# EAGLE design Ultrassom Breakout - V1 (EAGLE 9.6.2)

## Sheet 1 of 2
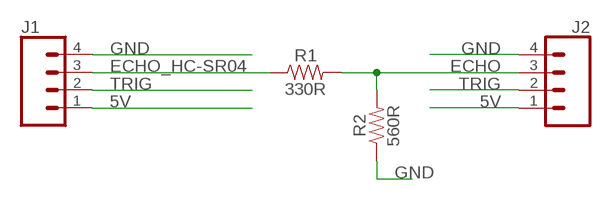
[diagram p0: schematic, sheet 1]

### Parts
J1  CONN_041X04_NO_SILK  [1X04_NO_SILK]
J2  CONN_041X04_NO_SILK  [1X04_NO_SILK]
R1  330R  RESISTORAXIAL-0.3-KIT  [AXIAL-0.3-KIT]
R2  560R  RESISTORAXIAL-0.3-KIT  [AXIAL-0.3-KIT]

### Nets
5V: J1.1 J2.1
ECHO: J2.3 R1.P$2 R2.P$2
ECHO_HC-SR04: J1.3 R1.P$1
GND: J1.4 J2.4 R2.P$1
TRIG: J1.2 J2.2

## Sheet 2 of 2

## Library data of the parts
J1 J2 = SparkFun-Connectors:CONN_04: Multi connection point. Often used as Generic Header-pin footprint for 0.1 inch spaced/style header connections On any of the 0.1 inch spaced packages, you can populate with these: Break Away Headers - Straight <https://www.sparkfun.com/products/116> (PRT-00116) Break Away Male Headers - Right Angle <https://www.sparkfun.com/products/553> (PRT-00553) Female Headers <https://www.sparkfun.com/products/115> (PRT-00115) Break Away Headers - Machine Pin <https://www.sparkfun.com/products/117> (PRT-00117) Break Away Female Headers - Swiss Machine Pin <https://www.sparkfun.com/products/743> (PRT-00743) For SCREWTERMINALS and SPRING TERMINALS visit here: Screw Terimnals on SparkFun.com <https://www.sparkfun.com/search/results?term=Screw+Terminals> (5mm/3.5mm/2.54mm spacing) This device is also useful as a general connection point to wire up your design to another part of your project. Our various solder wires solder well into these plated through hole pads. Hook-Up Wire - Assortment (Stranded, 22 AWG) <https://www.sparkfun.com/products/11375> (PRT-11375) Hook-Up Wire - Assortment (Solid Core, 22 AWG) <https://www.sparkfun.com/products/11367> (PRT-11367) View the entire wire category on our website here <https://www.sparkfun.com/categories/141> Special notes: Molex polarized connector foot print use with SKU : PRT-08231 with associated crimp pins and housings. 1MM SMD Version SKU: PRT-10208; PROD_ID: CONN-09696
R1 R2 = SparkFun-Resistors:RESISTOR: Generic Resistor Package

## Net classes
0 default: width 0.305 mm, drill 0.457 mm, clearance 0.254 mm

## Board
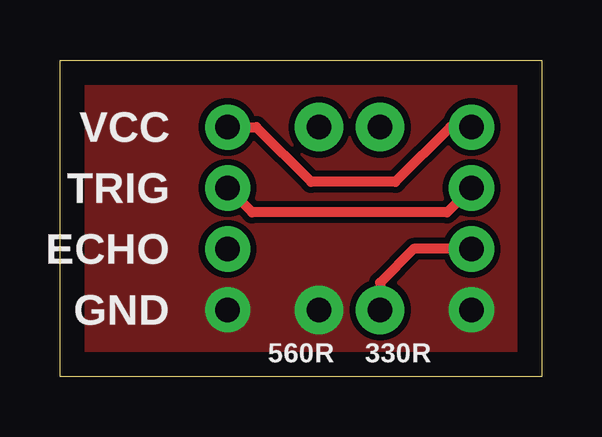
[diagram p1: board, top side]
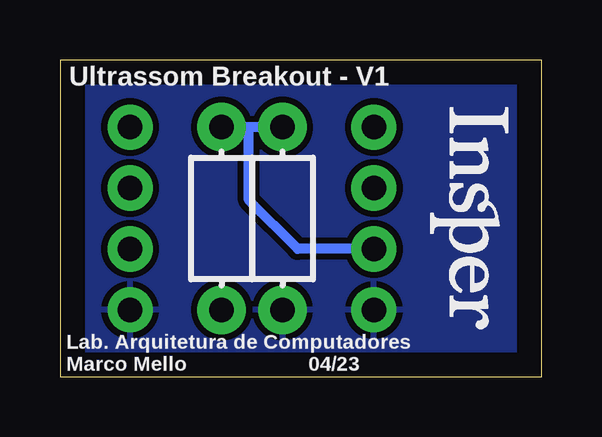
[diagram p2: board, bottom side, seen from below]

Size 20.07 x 13.21 mm. Coordinates in mm from the lower left corner, seen from the top.
Outline: 20.07,0 0,0 0,13.21 20.07,13.21 20.07,0
Copper layers (1*16): Top 0.035mm / dielectric 1.5mm / Bottom 0.035mm
Design rules "default": minimum track width 6mil, minimum drill 0.35mm, track to track 6mil, track to pad 6mil, pad to pad 6mil, via to via 6mil, smd to smd 6mil, copper to edge 40mil, drill to drill 6mil, minimum pad ring 10mil, minimum via ring 8mil, stop-mask expansion 4mil, vias tented up to drill 0mil, thermal gap 10mil

### Footprints (pad centres in the part's own frame; a part is rotated, then mirrored left to right if it is on the bottom)
1X04_NO_SILK = drill 1.016 pad 1.88: 1 0,0; 2 2.54,0; 3 5.08,0; 4 7.62,0
AXIAL-0.3-KIT = drill 1.016 pad 2.032: P$1 -3.81,0; P$2 3.81,0

### Placement (x,y rotation side)
J1  17.14,10.41 270 bottom
J2  6.99,10.41 270 bottom
R1  13.34,6.6 90 bottom
R2  10.79,6.6 90 bottom

### Tracks (layer width: path | path; a pad name or v marks a point on that pad's centre or on a via)
5V
  Top 0.406: J1.1 16.26,10.41 13.97,8.13 10.46,8.13 8.18,10.41 J2.1
ECHO
  Bottom 0.406: R2.P$2 12.19,10.41 | 12.19,10.41 R1.P$2 | J2.3 10.16,5.33 12.19,7.37 12.19,10.41
ECHO_HC-SR04
  Top 0.406: J1.3 14.73,5.33 13.34,3.94 R1.P$1
GND
  pour Top (no thermals): 20.07,0 0,0 0,13.21 20.07,13.21
  pour Bottom: 0,0 20.07,0 20.07,13.21 0,13.21
TRIG
  Top 0.406: J1.2 16.13,6.86 8,6.86 J2.2

### Text on the board
tPlace: VCC | TRIG | ECHO | GND
bPlace: Ultrassom Breakout - V1 | Lab. Arquitetura de Computadores / Marco Mello 04/23